# EAGLE design LED Matrix Driver(HT16K33) v1.0 (EAGLE 6.4)
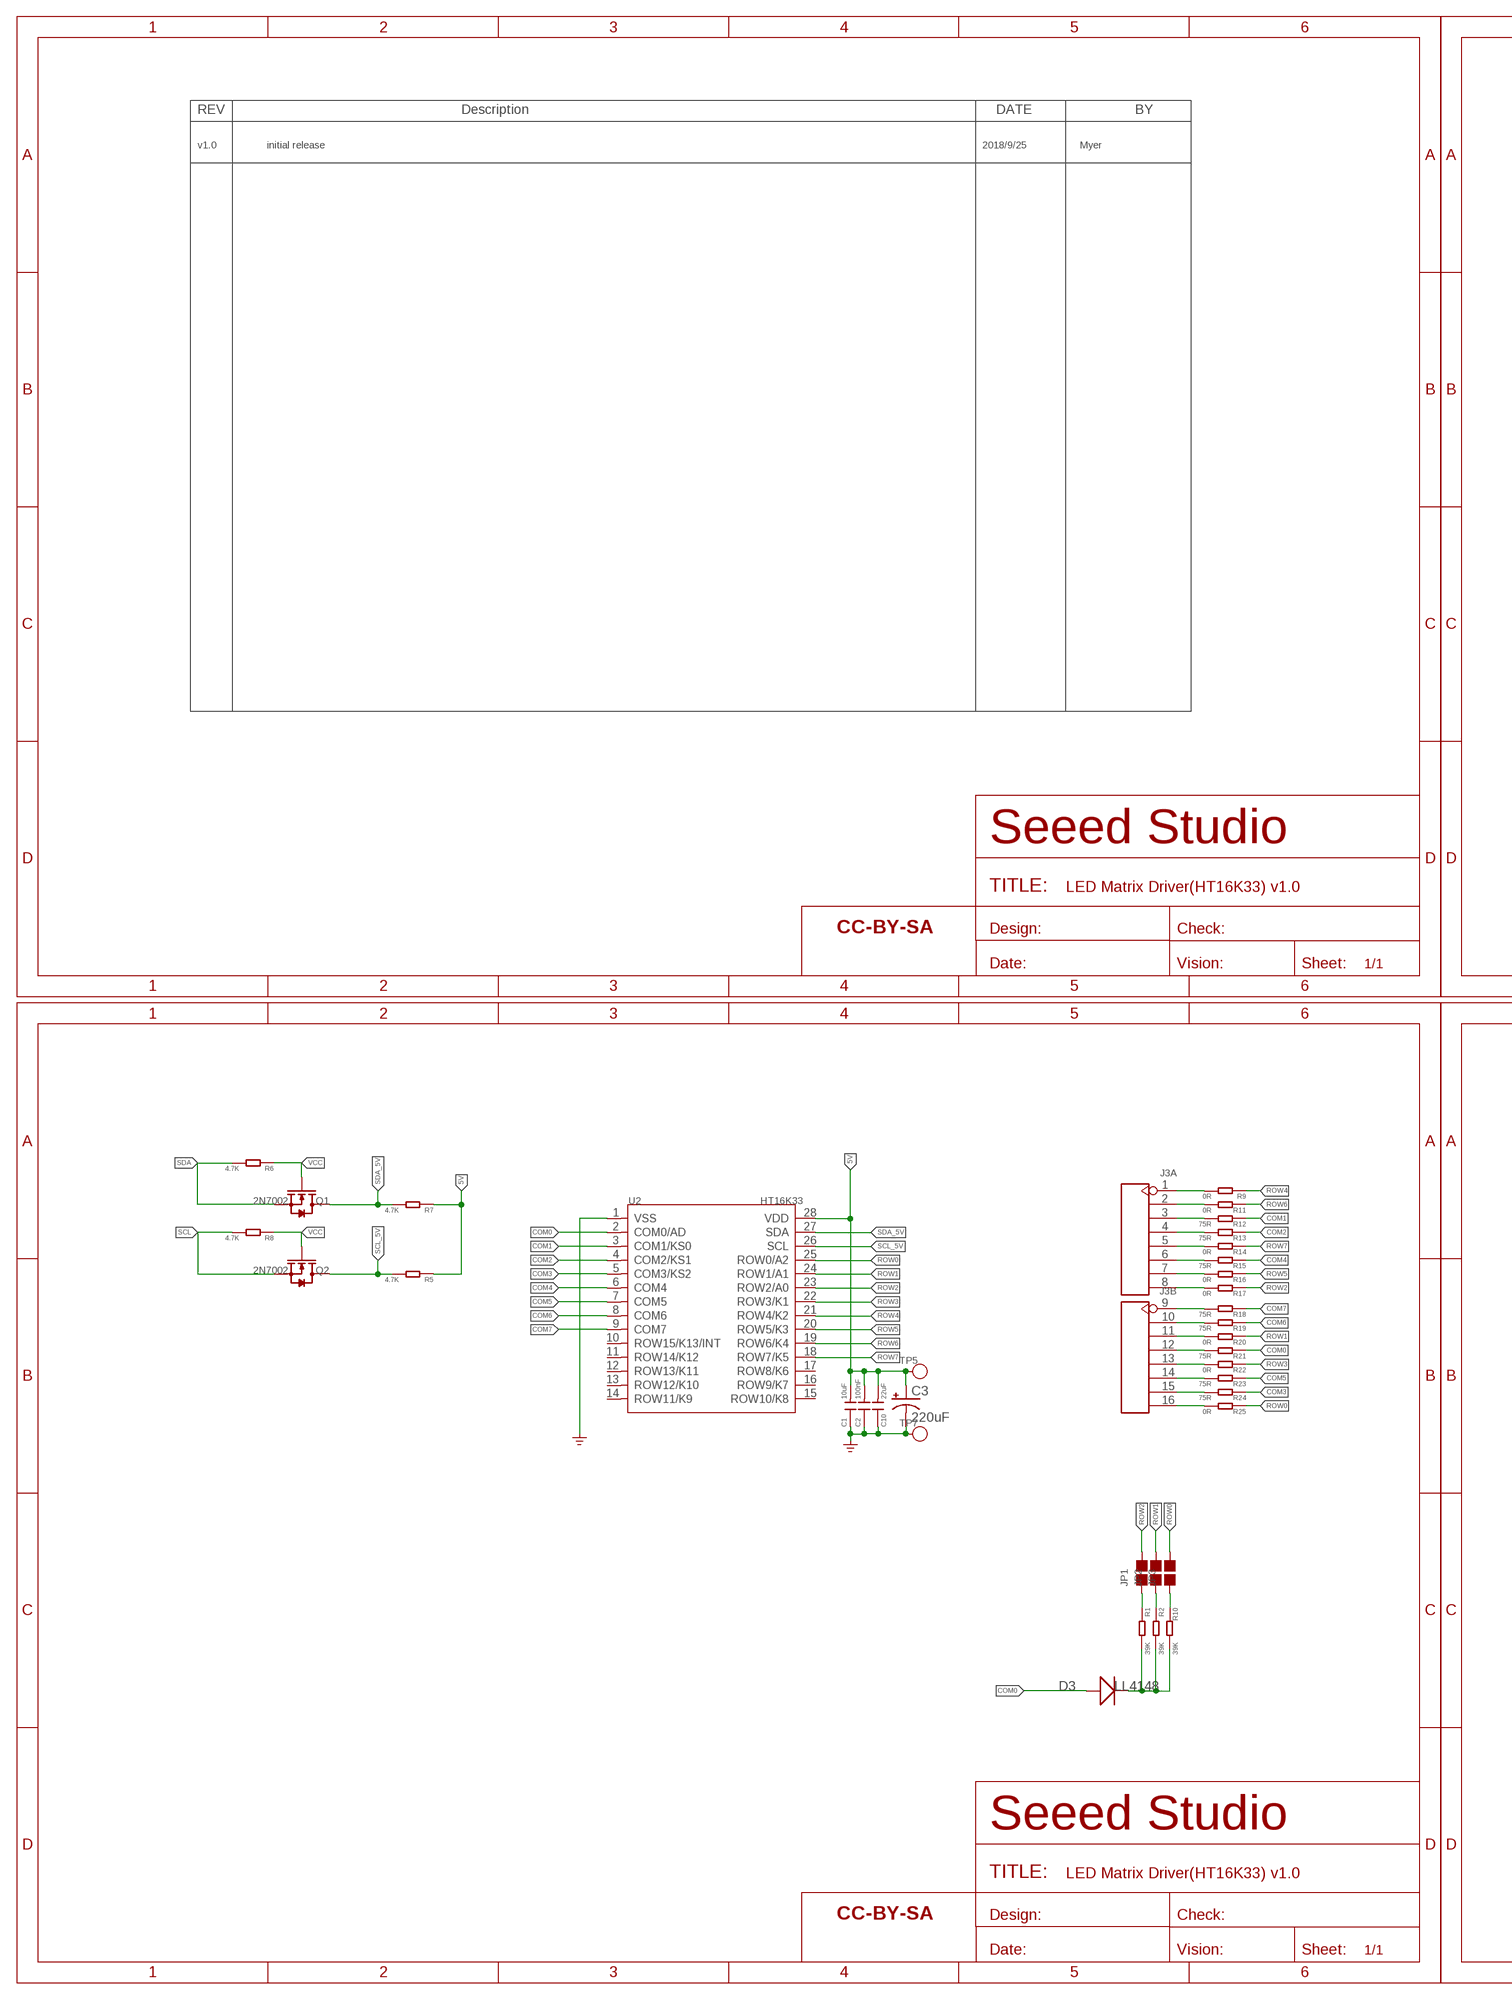
[diagram p0: schematic, sheet 1, part 1 of 2]
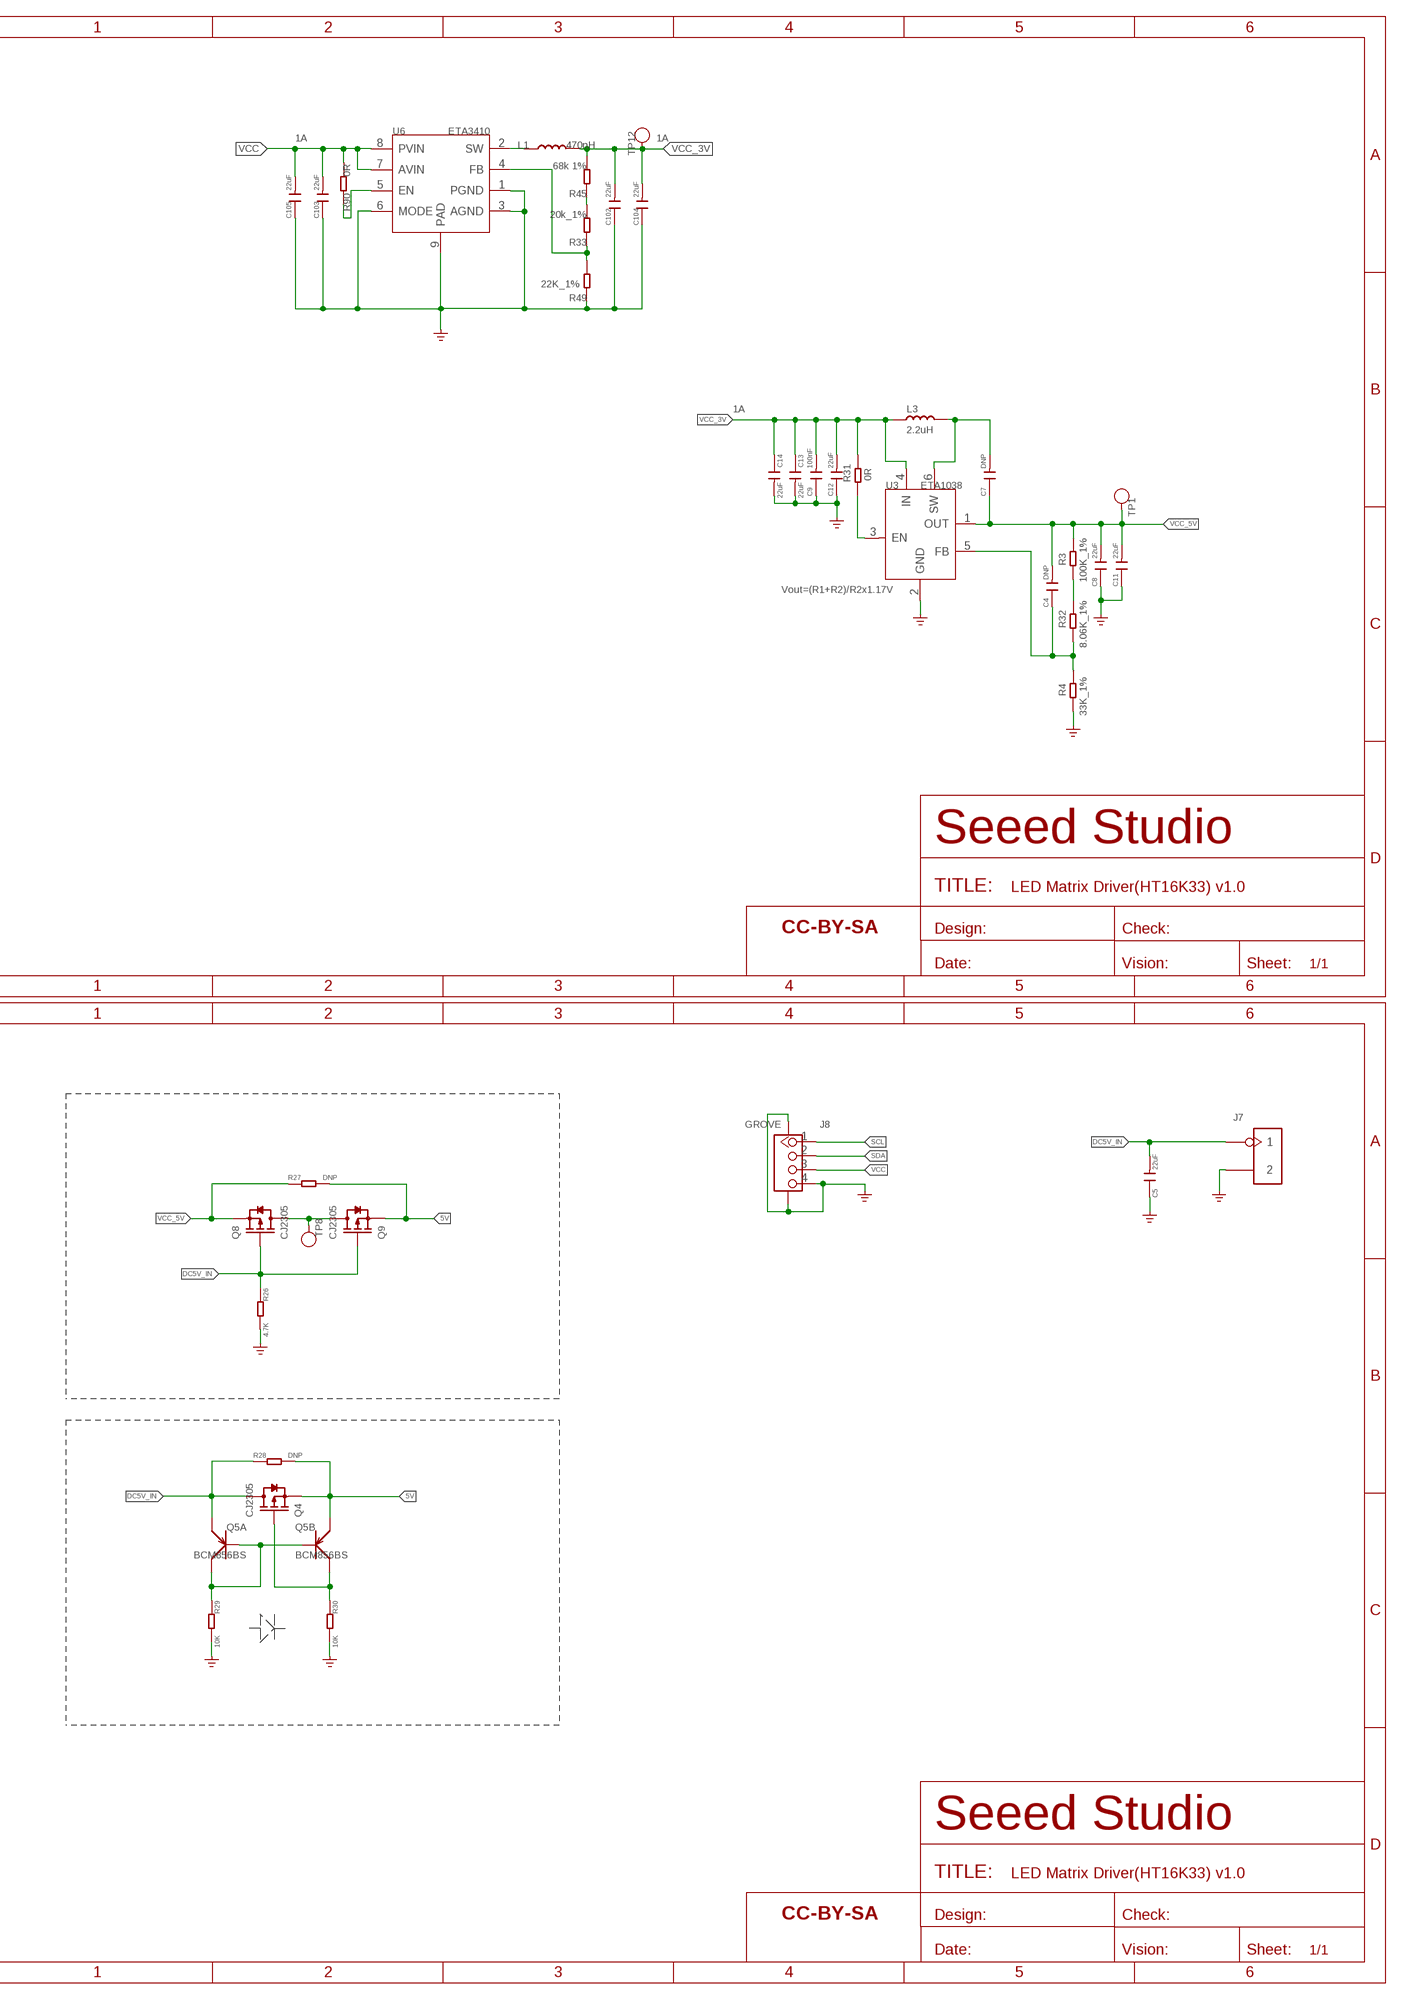
[diagram p1: schematic, sheet 1, part 2 of 2]

## Parts
C1  10uF  C-0805  [C0805]
C2  100nF  C-0603  [C0603]
C3  220uF  CPOL-USD  [PANASONIC_D]
C4  DNP  C-0603  [C0603]
C5  22uF  C-0805  [C0805]
C7  DNP  C-0603  [C0603]
C8  22uF  C-0603  [C0603]
C9  100nF  C-0603  [C0603]
C10  22uF  C-0805  [C0805]
C11  22uF  C-0603  [C0603]
C12  22uF  C-0603  [C0603]
C13  22uF  C-0603  [C0603]
C14  22uF  C-0603  [C0603]
C102  22uF  C-0603  [C0603]
C103  22uF  C-0603  [C0603]
C104  22uF  C-0603  [C0603]
C105  22uF  C-0603  [C0603]
D3  LL4148  D'1N4148-SMD'  [DO-35-SMD]
FR1  SEEEDSTUDIO-OPEN-SCH-FRAME  [SEEEDSTUDIO-PCB-FRAME]
FR2  SEEEDSTUDIO-OPEN-SCH-FRAME  [SEEEDSTUDIO-PCB-FRAME]
FR3  SEEEDSTUDIO-OPEN-SCH-FRAME  [SEEEDSTUDIO-PCB-FRAME]
J3  HEADER-1X8PX2-LED-28.5MM  [H8X2-SMD-2.54-28.5MM]
J7  HEADER-2P-65/35MIL  [H2-2.54]
J8  GROVE  GROVE-CONNECTOR-SMD'DD'  [HW4-SMD-2.0]
JP1  JP-2P-NO  [2P-SMD-NO]
JP2  JP-2P-NO  [2P-SMD-NO]
JP3  JP-2P-NO  [2P-SMD-NO]
L1  470nH  L-MPM201610SR33_T  [L201610]
L3  2.2uH  INDUCTOR/FERRITE-BEAD'0806'  [L0806]
Q1  2N7002  MOSFET-N'SOT23'  [SOT-23]
Q2  2N7002  MOSFET-N'SOT23'  [SOT-23]
Q4  CJ2305  MOSFET-P'SI2323CDS/SI2305DS<BR>'  [SOT-23]
Q5  BCM856BS  TRANSISTOR-DUAL-PNP  [SOT-363]
Q8  CJ2305  MOSFET-P'SI2323CDS/SI2305DS<BR>'  [SOT-23]
Q9  CJ2305  MOSFET-P'SI2323CDS/SI2305DS<BR>'  [SOT-23]
R1  39K  R-0603  [R0603]
R2  39K  R-0603  [R0603]
R3  100K_1%  R-0603  [R0603]
R4  33K_1%  R-0603  [R0603]
R5  4.7K  R-0603  [R0603]
R6  4.7K  R-0603  [R0603]
R7  4.7K  R-0603  [R0603]
R8  4.7K  R-0603  [R0603]
R9  0R  R-0603  [R0603]
R10  39K  R-0603  [R0603]
R11  0R  R-0603  [R0603]
R12  75R  R-0603  [R0603]
R13  75R  R-0603  [R0603]
R14  0R  R-0603  [R0603]
R15  75R  R-0603  [R0603]
R16  0R  R-0603  [R0603]
R17  0R  R-0603  [R0603]
R18  75R  R-0603  [R0603]
R19  75R  R-0603  [R0603]
R20  0R  R-0603  [R0603]
R21  75R  R-0603  [R0603]
R22  0R  R-0603  [R0603]
R23  75R  R-0603  [R0603]
R24  75R  R-0603  [R0603]
R25  0R  R-0603  [R0603]
R26  4.7K  R-0603  [R0603]
R27  DNP  R-0603  [R0603]
R28  DNP  R-0603  [R0603]
R29  10K  R-0603  [R0603]
R30  10K  R-0603  [R0603]
R31  0R  R-0603  [R0603]
R32  8.06K_1%  R-0603  [R0603]
R33  20k_1%  R-0603  [R0603]
R45  68k 1%  R-0603  [R0603]
R49  22K_1%  R-0603  [R0603]
R90  0R  R-0603  [R0603]
TP1  TEST-POINT'4545'  [TP-D45MIL]
TP5  TEST-POINT'4545'  [TP-D45MIL]
TP7  TEST-POINT'4545'  [TP-D45MIL]
TP8  TEST-POINT'4545'  [TP-D45MIL]
TP12  TEST-POINT'4545'  [TP-D45MIL]
U2  HT16K33  DRIVER-HT16K33-28P  [SOP28-1.27-18.2X7.4MM]
U3  ETA1038  CONVERTER-ETA1038  [SOT-23-6]
U6  ETA3410  CONVERTER-ETA3410  [DFN8G-0.5-2X2MM]
U$1  SEEEDSTUDIO-OPEN-SCH-FRAME  [SEEEDSTUDIO-PCB-FRAME]

## Nets
5V: C1.2 C2.2 C3.+ C10.2 Q4.2(S) Q5.4(B:E) Q9.2(S) R5.1 R7.1 R27.2 R28.2 TP5.T U2.28(VDD)
COM0: D3.A(+) R21.1 U2.2(COM0/AD)
COM1: R12.1 U2.3(COM1/KS0)
COM2: R13.1 U2.4(COM2/KS1)
COM3: R24.1 U2.5(COM3/KS2)
COM4: R15.1 U2.6(COM4)
COM5: R23.1 U2.7(COM5)
COM6: R19.1 U2.8(COM6)
COM7: R18.1 U2.9(COM7)
DC5V_IN: C5.2 J7.1 Q4.3(D) Q5.1(A:E) Q8.1(G) Q9.1(G) R26.1 R28.1
GND: C1.1 C2.1 C3.- C5.1 C8.1 C9.1 C10.1 C11.1 C12.1 C13.2 C14.2 C102.1 C103.1 C104.1 C105.1 J7.2 J8.4 J8.SS1 J8.SS2 R4.1 R26.2 R29.2 R30.2 R49.1 TP7.T U2.1(VSS) U3.2(GND) U6.1(PGND) U6.3(AGND) U6.6(MODE) U6.9(PAD) ; supply symbol labelled GND_POWER
N$1: D3.C(-) R1.2 R2.2 R10.2
N$2: JP1.1 R1.1
N$3: L1.1 U6.2(SW)
N$4: R90.1 U6.5(EN)
N$5: J3.1 R9.2
N$6: JP2.1 R2.1
N$7: JP3.1 R10.1
N$8: R33.2 R45.1
N$10: J3.2 R11.2
N$11: Q5.2(A:B) Q5.5(B:B) Q5.6(A:C) R29.1
N$12: J3.3 R12.2
N$13: Q4.1(G) Q5.3(B:C) R30.1
N$14: J3.4 R13.2
N$15: J3.5 R14.2
N$16: J3.6 R15.2
N$17: J3.7 R16.2
N$18: J3.8 R17.2
N$19: J3.9 R18.2
N$20: J3.10 R19.2
N$21: J3.11 R20.2
N$22: J3.12 R21.2
N$23: J3.13 R22.2
N$24: J3.14 R23.2
N$25: J3.15 R24.2
N$26: J3.16 R25.2
N$28: C7.2 L3.2 U3.6(SW)
N$29: Q8.3(D) Q9.3(D) TP8.T
N$30: C4.1 R4.2 R32.2 U3.5(FB)
N$31: R31.2 U3.3(EN)
N$32: R3.2 R32.1
N$49: R33.1 R49.2 U6.4(FB)
ROW0: JP3.2 R25.1 U2.25(ROW0/A2)
ROW1: JP2.2 R20.1 U2.24(ROW1/A1)
ROW2: JP1.2 R17.1 U2.23(ROW2/A0)
ROW3: R22.1 U2.22(ROW3/K1)
ROW4: R9.1 U2.21(ROW4/K2)
ROW5: R16.1 U2.20(ROW5/K3)
ROW6: R11.1 U2.19(ROW6/K4)
ROW7: R14.1 U2.18(ROW7/K5)
SCL: J8.1 Q2.2(S) R8.2
SCL_5V: Q2.3(D) R5.2 U2.26(SCL)
SDA: J8.2 Q1.2(S) R6.2
SDA_5V: Q1.3(D) R7.2 U2.27(SDA)
VCC: C103.2 C105.2 J8.3 Q1.1(G) Q2.1(G) R6.1 R8.1 R90.2 U6.7(AVIN) U6.8(PVIN)
VCC_3V: C9.2 C12.2 C13.1 C14.1 C102.2 C104.2 L1.2 L3.1 R31.1 R45.2 TP12.T U3.4(IN)
VCC_5V: C4.2 C7.1 C8.2 C11.2 Q8.2(S) R3.1 R27.1 TP1.T U3.1(OUT)
Unconnected: U2.10(ROW15/K13/INT) U2.11(ROW14/K12) U2.12(ROW13/K11) U2.13(ROW12/K10) U2.14(ROW11/K9) U2.15(ROW10/K8) U2.16(ROW9/K7) U2.17(ROW8/K6)

## Notes on the sheet
- 1A | 1A
- v1.0 | initial release | 2018/9/25 | Myer
- 1A
- Vout=(R1+R2)/R2x1.17V

## Library data of the parts
C1 C2 C4 C5 C7-C14 C102-C105 = Discrete-small:C*: Ceramic Capacitors
C3 = rcl:CPOL-US: POLARIZED CAPACITOR, American symbol
D3 = Discrete:D*
FR1-FR3 U$1 = moudle-new:SEEEDSTUDIO-OPEN-SCH-FRAME
J3 = Connector-new:HEADER-1X8PX2-LED
J7 = Connector-new:HEADER-2P
J8 = Connector-new:GROVE-CONNECTOR-SMD: 4P-SMD-2.0:320110030;4P-SMD-2.0-90D:320110032
JP1-JP3 = Discrete-new:JP-2P-NO
L1 = Discrete-new:L
L3 = Discrete-new:INDUCTOR/FERRITE-BEAD
Q1 Q2 = Discrete-new:MOSFET-N
Q4 Q8 Q9 = Discrete-new:MOSFET-P
Q5 = Discrete-new:TRANSISTOR-DUAL-PNP
R1-R33 R45 R49 R90 = Discrete-small:R*
TP1 TP5 TP7 TP8 TP12 = Discrete-new:TEST-POINT; PARTNO: DNP
U2 = IC-new:DRIVER-HT16K33-28P
U3 = IC-new:CONVERTER-ETA1038
U6 = IC-new:CONVERTER-ETA3410: 3MHZ 2A High Step-Down Converter in DFN2x2-8L Package

## Board
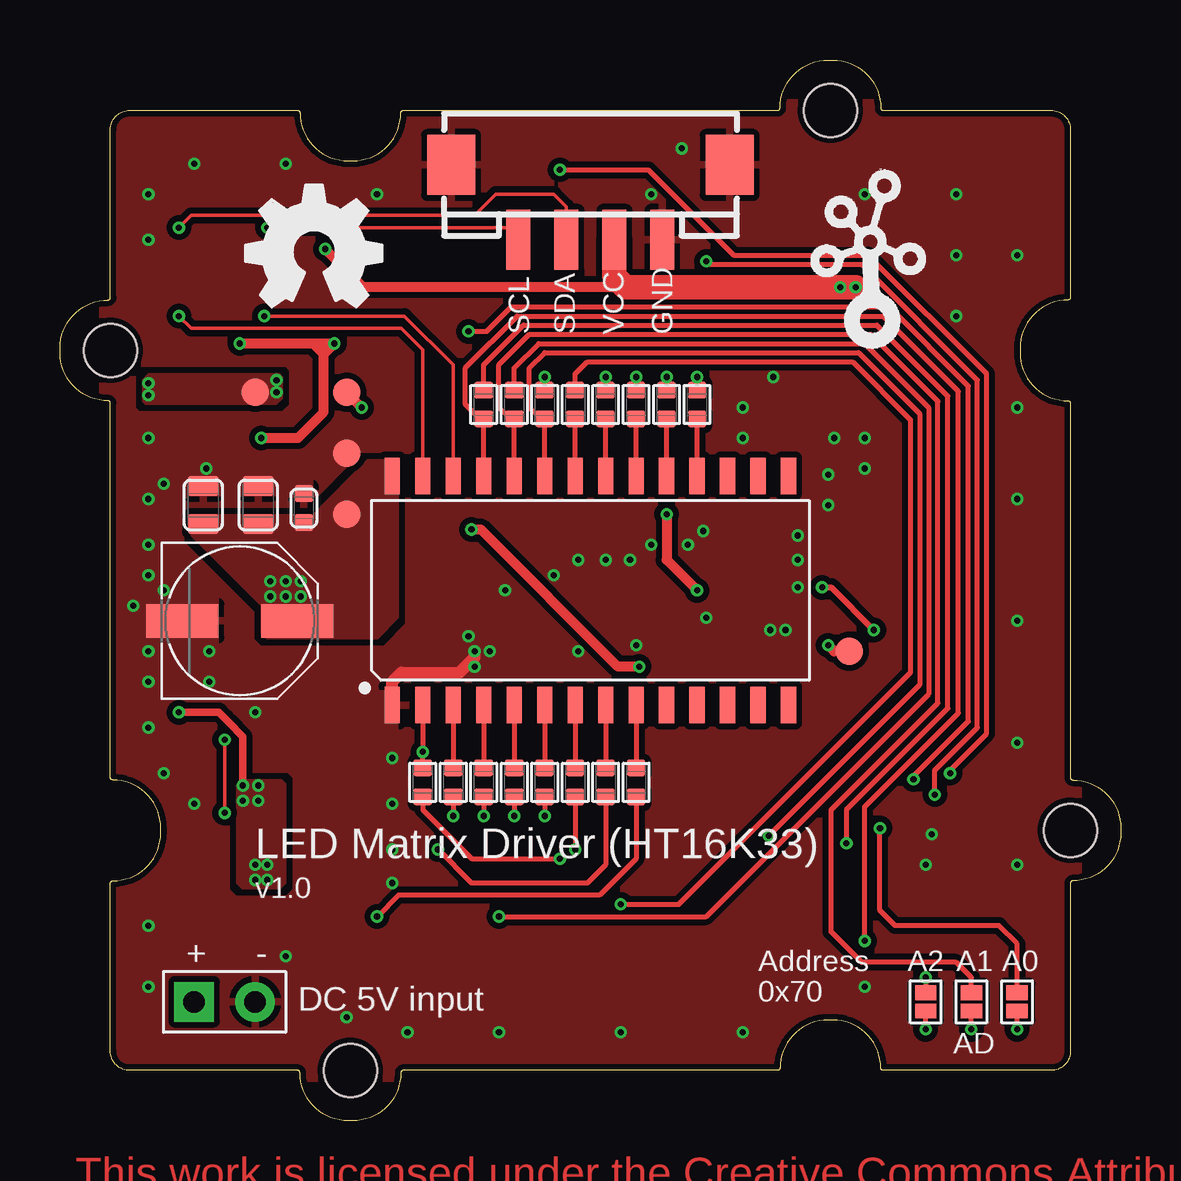
[diagram p2: board, top side]
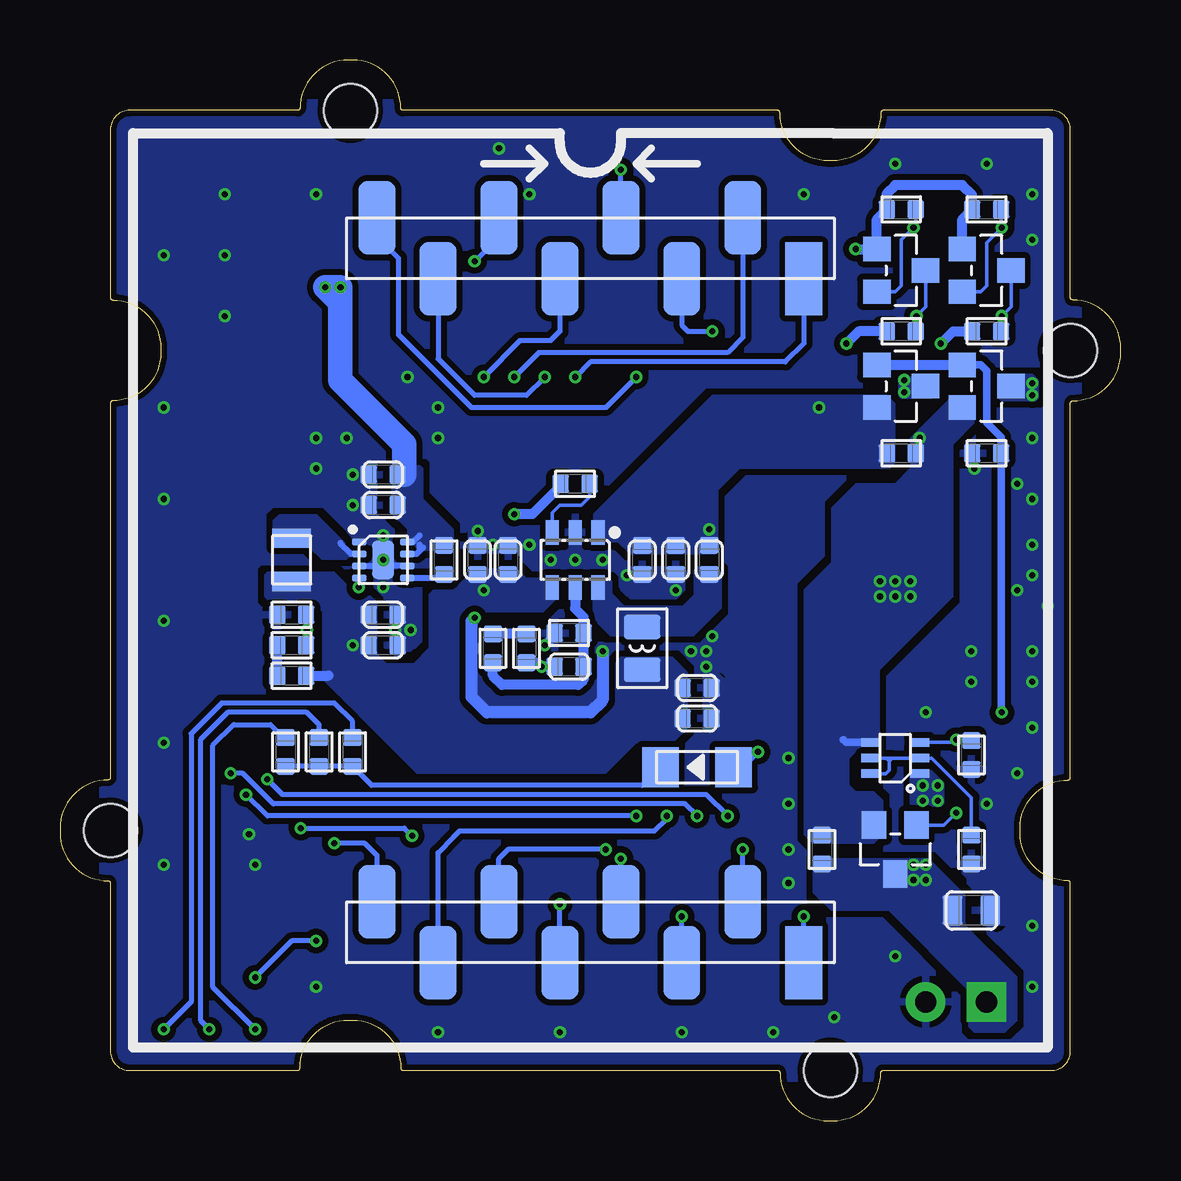
[diagram p3: board, bottom side, seen from below]

Size 44.2 x 44.2 mm. Coordinates in mm from the lower left corner, seen from the top.
Copper layers (1*16): Top 0.035mm / dielectric 1.5mm / Bottom 0.035mm
Design rules "SeeedStudio_2layer_DRU_no_angle_20140221 *": minimum track width 1mil, minimum drill 10mil, track to track 6mil, track to pad 6mil, pad to pad 6mil, via to via 6mil, smd to smd 0mil, copper to edge 10mil, drill to drill 10mil, minimum pad ring 4mil, minimum via ring 4mil, stop-mask expansion 2mil, vias tented up to drill 25mil, thermal gap 10mil

### Footprints (pad centres in the part's own frame; a part is rotated, then mirrored left to right if it is on the bottom)
C0805 = smd 0.819 x 1.27: 1 -0.79,0; 2 0.79,0
C0603 = smd 0.762 x 0.696: 1 0,0.602; 2 0,-0.602
PANASONIC_D = smd 3 x 1.4: + 2.4,0; - -2.4,0
DO-35-SMD = smd 1.524 x 1.676: A -1.524,0; C 1.524,0
H8X2-SMD-2.54-28.5MM = smd 3.048 x 1.524: 1 -12.98,8.89; 2 -15.52,6.35; 3 -12.98,3.81; 4 -15.52,1.27; 5 -12.98,-1.27; 6 -15.52,-3.81; 7 -12.98,-6.35; 8 -15.52,-8.89; 9 15.52,8.89; 10 12.98,6.35; 11 15.52,3.81; 12 12.98,1.27; 13 15.52,-1.27; 14 12.98,-3.81; 15 15.52,-6.35; 16 12.98,-8.89
H2-2.54 = drill 0.889 pad 1.651 square: 1 0,1.27 | drill 0.889 pad 1.651: 2 0,-1.27
HW4-SMD-2.0 = smd 1 x 2.5: 1 -3,0; 2 -1,0; 3 1,0; 4 3,0 | smd 2 x 2.5: SS1 -5.8,3.123; SS2 5.8,3.123
2P-SMD-NO = smd 0.889 x 0.61: 1 0,0.381; 2 0,-0.381
L201610 = smd 0.8 x 1.6: 1 -0.9,0; 2 0.9,0
L0806 = smd 1.016 x 1.524: 1 -0.889,0; 2 0.889,0
SOT-23 = smd 1.143 x 1.016: 1 1.016,-0.889; 2 1.016,0.889; 3 -1.016,0
SOT-363 = smd 0.35 x 0.8: 1 -0.65,-1.025; 2 0,-1.025; 3 0.65,-1.025; 4 0.65,1.025; 5 0,1.025; 6 -0.65,1.025
R0603 = smd 0.762 x 0.696: 1 0,0.602; 2 0,-0.602
TP-D45MIL = smd 1.143 x 1.143: T 0,0
SOP28-1.27-18.2X7.4MM = smd 0.635 x 1.524: 1 -8.255,-4.775; 2 -6.985,-4.775; 3 -5.715,-4.775; 4 -4.445,-4.775; 5 -3.175,-4.775; 6 -1.905,-4.775; 7 -0.635,-4.775; 8 0.635,-4.775; 9 1.905,-4.775; 10 3.175,-4.775; 11 4.445,-4.775; 12 5.715,-4.775; 13 6.985,-4.775; 14 8.255,-4.775; 15 8.255,4.775; 16 6.985,4.775; 17 5.715,4.775; 18 4.445,4.775; 19 3.175,4.775; 20 1.905,4.775; 21 0.635,4.775; 22 -0.635,4.775; 23 -1.905,4.775; 24 -3.175,4.775; 25 -4.445,4.775; 26 -5.715,4.775; 27 -6.985,4.775; 28 -8.255,4.775
SOT-23-6 = smd 0.55 x 1.016: 1 -0.95,-1.143; 2 0,-1.143; 3 0.95,-1.143; 4 0.95,1.143; 5 0,1.143; 6 -0.95,1.143
DFN8G-0.5-2X2MM = smd 0.6 x 0.3: 1 -1,0.75; 2 -1,0.25; 3 -1,-0.25; 4 -1,-0.75; 5 1,-0.75; 6 1,-0.25; 7 1,0.25; 8 1,0.75 | smd 0.9 x 1.6: 9 0,0
2X2U-DIM-W/-DRILL = hole 2.2: 10,20; -20,10; -10,-20; 20,-10

### Placement (x,y rotation side)
C1  8.26,25.66 270 top
C2  10.16,25.53 0 top
C3  7.5,20.83 0 top
C4  22.99,18.93 270 bottom
C5  6.23,8.77 180 bottom
C7  17.15,23.37 0 bottom
C8  19.94,23.37 180 bottom
C9  25.53,23.37 0 bottom
C10  5.97,25.66 270 top
C11  18.54,23.37 180 bottom
C12  26.8,23.37 0 bottom
C13  17.66,18.04 90 bottom
C14  17.66,16.77 90 bottom
C102  30.74,21.08 270 bottom
C103  30.74,26.93 90 bottom
C104  30.74,19.81 270 bottom
C105  30.74,25.66 90 bottom
D3  17.66,14.73 180 bottom
FR1  0.64,-6.6 0 top  (outside the outline)
FR2  0.64,-19.81 0 top  (outside the outline)
FR3  0.64,-26.41 0 top  (outside the outline)
J3  22.1,22.1 270 bottom
J7  6.86,4.96 90 top
J8  22.1,36.7 0 top
JP1  39.88,4.96 180 top
JP2  37.98,4.96 180 top
JP3  36.07,4.96 180 top
L1  34.55,23.37 270 bottom
L3  19.94,19.69 90 bottom
Q1  5.59,35.44 180 bottom
Q2  9.15,35.44 180 bottom
Q4  9.4,11.31 90 bottom
Q5  9.4,15.12 90 bottom
Q8  9.15,30.61 180 bottom
Q9  5.59,30.61 180 bottom
R1  32.01,15.37 0 bottom
R2  33.4,15.37 0 bottom
R3  24.77,19.69 180 bottom
R4  22.99,20.32 90 bottom
R5  9.15,32.9 90 bottom
R6  5.59,37.98 90 bottom
R7  5.59,32.9 90 bottom
R8  9.15,37.98 90 bottom
R9  22.74,29.85 180 top
R10  34.8,15.37 0 bottom
R11  25.28,29.85 180 top
R12  16.39,14.1 0 top
R13  17.66,14.1 0 top
R14  26.55,29.85 180 top
R15  20.2,14.1 0 top
R16  24.01,29.85 180 top
R17  20.2,29.85 180 top
R18  24.01,14.1 0 top
R19  22.74,14.1 0 top
R20  18.93,29.85 180 top
R21  15.12,14.1 0 top
R22  21.46,29.85 180 top
R23  21.46,14.1 0 top
R24  18.93,14.1 0 top
R25  17.66,29.85 180 top
R26  5.59,27.82 270 bottom
R27  9.15,27.82 90 bottom
R28  12.45,11.31 180 bottom
R29  6.23,11.31 0 bottom
R30  6.23,15.24 0 bottom
R31  22.74,26.55 90 bottom
R32  26.16,19.69 0 bottom
R33  34.55,19.81 270 bottom
R45  34.55,18.54 90 bottom
R49  34.55,21.08 90 bottom
R90  28.2,23.37 180 bottom
TP1  11.94,30.36 0 top
TP5  11.94,25.28 0 top
TP7  11.94,27.82 0 top
TP8  8.13,30.36 0 top
TP12  32.9,19.56 270 top
U2  22.1,22.1 0 top
U3  22.74,23.37 180 bottom
U6  30.74,23.37 0 bottom
U$1  0.64,-13.21 0 top  (outside the outline)
U$3  [2X2U-DIM-W/-DRILL]  22.1,22.1 0 top
U$4  [OSHW_FILLX200_NOTEXT]  7.75,33.91 0 top
U$5  [TWIGLOGO]  33.78,33.15 0 top

### Tracks (layer width: path | path; a pad name or v marks a point on that pad's centre or on a via)
5V  (via drill 0.25 pad 0.51)
  Top 0.406: 10.99,32.39 v11.43,32.39 10.99,31.94 | 10.99,32.39 10.54,32.39 | 10.54,32.39 v7.5,32.39 | v8.38,28.45 9.91,28.45 10.99,29.53 10.99,31.92 10.99,31.94 | 10.99,31.94 10.99,32.39 | 10.99,31.94 10.54,32.39
  Bottom 0.305: Q5.4 11.45,15.77 11.56,15.88
  Bottom 0.406: R5.1 10.92,32.9 v11.43,32.39 | v7.5,32.39 6.99,32.9 R7.1
  other vias: 8.77,21.85 9.4,21.85 10.04,21.85 10.04,22.48 9.4,22.48 8.77,22.48
  pour Bottom (isolate 0.254, rank 2, no thermals): 12.83,11.56 10.29,11.56 9.91,11.94 9.91,13.34 10.29,13.72 11.05,13.72 11.31,13.97 11.31,15.12 10.67,15.75 10.16,15.75 10.04,15.88 10.04,18.8 6.99,21.85 6.99,23.24 7.11,23.37 11.94,23.37 13.21,22.1 13.21,11.94
  pour Bottom (isolate 0.254, no thermals): 11.94,23.12 6.99,23.12 6.99,28.2 6.1,29.09 6.1,29.85 6.35,30.1 7.11,30.1 8.77,28.45 8.77,27.18 9.4,26.55 11.05,26.55 12.07,25.53 12.07,23.24
  pour Top (isolate 0.254, no thermals): 9.65,20.07 8.64,20.07 8.38,20.32 8.38,21.46 5.46,24.39 5.46,25.02 5.72,25.28 10.54,25.28 12.83,27.56 13.85,27.56 14.1,27.31 14.1,20.96 13.21,20.07
COM0  (via drill 0.25 pad 0.51)
  Top 0.203: U2.2 v15.12,15.37 R21.1
  Bottom 0.203: D3.A 15.75,14.73 v15.12,15.37
COM1
  Top 0.203: U2.3 R12.1
COM2
  Top 0.203: U2.4 R13.1
COM3
  Top 0.203: U2.5 R24.1
COM4
  Top 0.203: U2.6 R15.1 20.2,14.61
COM5
  Top 0.203: U2.7 R23.1
COM6
  Top 0.203: U2.8 R19.1
COM7
  Top 0.203: U2.9 R18.1
DC5V_IN  (via drill 0.25 pad 0.51)
  Top 0.305: v7.62,13.97 7.62,16 7.05,16.58 6.86,16.77 6.61,17.02 v4.96,17.02
  Bottom 0.305: Q9.1 5.84,31.5 5.59,31.24 5.59,29.09 4.99,28.48 R26.1 4.99,17.05 v4.96,17.02
  Bottom 0.406: Q8.1 Q9.1
  other vias: 8.26,13.97 7.62,13.34 8.26,13.34 8.13,10.67 8.64,10.67 8.64,10.04 8.13,10.04
  pour Bottom (isolate 0.254, no thermals): 5.59,3.69 4.83,3.69 4.32,4.19 4.32,5.97 6.48,8.13 6.48,9.4 8,10.92 12.45,10.92 12.83,10.54 12.83,9.53 12.07,8.77 9.68,8.77 6.35,5.44 6.35,3.94 6.1,3.69
  pour Top (isolate 0.254, no thermals): 8.26,14.23 9.22,14.23 9.4,14.05 9.4,9.91 9.15,9.65 7.62,9.65 7.37,9.91 7.37,13.97 7.62,14.23
  pour Bottom (isolate 0.254, no thermals): 8.26,14.61 7.88,14.61 7.37,14.1 7.37,13.21 7.5,13.08 8.64,13.08 8.77,13.21 8.77,14.48 8.64,14.61
GND  (via drill 0.25 pad 0.51)
  Top 0.508: U2.1 13.85,18.29 14.23,18.67 16.64,18.67 17.27,19.31 v17.27,19.56
  Bottom 0.254: U6.3 30.74,23.12 30.73,23.12 U6.6
  Bottom 0.305: R26.2 6.19,27.27 v6.1,27.18
  Bottom 0.406: R4.1 23.59,20.23 v24.01,19.81
  Bottom 0.508: v21.59,19.56 21.59,17.53 22.1,17.02 26.42,17.02 27.05,17.66 27.05,20.83 v26.93,20.96
  other vias: 18.54,22.1 20.58,22.74 21.59,23.37 22.74,23.37 23.75,23.37 24.64,24.01 26.16,24.01 26.8,24.58 17.91,19.56 13.85,13.21 13.85,11.31 13.85,9.91 30.74,23.37 30.74,24.39 30.74,22.23 30.23,20.45 29.59,20.45 39.88,20.83 32.01,25.66 32.01,26.93 24.64,38.61 25.91,40.52 13.85,15.12 17.27,18.93 17.02,20.2 39.88,15.75 39.88,10.67 36.07,10.67 36.32,11.94 39.88,25.91 39.88,29.72 37.34,33.53 37.34,38.61 39.88,36.07 37.34,36.07 33.53,38.61 33.53,27.18 33.53,28.45 32.26,28.45 28.45,28.45 28.45,29.72 29.72,30.99 33.53,5.59 28.45,3.69 23.37,3.69 18.29,3.69 14.48,3.69 11.94,4.32 9.4,6.86 3.69,5.59 3.69,8.13 4.32,14.48 3.69,28.45 3.69,36.7 3.69,38.61 5.59,39.88 9.4,39.88 13.21,38.61 3.05,21.46 3.69,19.56 4.32,22.1 3.69,22.74 3.69,24.01 3.69,25.91 4.32,26.55 6.23,19.56 6.23,18.29 3.69,18.29 8.13,17.02 3.69,16.39 5.59,13.21
  pour Bottom (isolate 0.254, no thermals): 20.45,23.12 18.29,23.12 18.16,22.99 18.16,22.1 18.42,21.85 20.58,21.85 20.83,22.1 20.83,22.61 21.21,22.99 24.51,22.99 25.15,23.62 26.93,23.62 27.18,23.88 27.18,24.51 26.8,24.89 24.64,24.89 24.39,24.64 24.39,24.13 24.01,23.75 23.12,23.75 22.99,23.88 22.99,24.77 22.86,24.89 22.61,24.89 22.48,24.77 22.48,23.88 22.35,23.75 21.08,23.75
  pour Top (isolate 0.254, no thermals): 13.72,17.91 12.7,17.91 12.32,17.53 12.32,15.62 12.83,15.12 13.85,15.12 14.1,15.37 14.1,17.66 13.85,17.91
  pour Bottom (isolate 0.254, no thermals): 30.23,19.56 29.59,19.56 29.34,19.81 29.34,21.46 30.36,22.48 30.36,24.64 30.99,25.28 30.99,27.69 31.12,27.82 32.01,27.82 32.26,27.56 32.26,24.51 31.88,24.13 31.24,24.13 31.12,24.01 31.12,22.23 30.48,21.59 30.48,19.69 30.36,19.56
  pour Bottom (isolate 0.254, no thermals): 5.59,11.05 4.96,11.05 4.19,10.29 4.19,8.51 4.57,8.13 5.46,8.13 5.72,8.38 5.72,9.4 6.61,10.29 6.61,10.8 6.35,11.05
  pour Bottom (isolate 0.254, rank 6): 1.78,42.42 42.42,42.42 42.42,1.78 1.78,1.78
  pour Top (isolate 0.254, rank 6): 1.78,42.42 42.42,42.42 42.42,1.78 1.78,1.78
  pour Bottom (isolate 0.254, no thermals): 18.04,19.81 17.15,19.81 16.89,19.56 16.89,18.8 16.26,18.16 16.26,16.39 16.52,16.12 17.26,16.12 17.4,16.26 17.4,18.67 18.16,19.43 18.16,19.69
  pour Bottom (isolate 0.254, no thermals): 21.85,18.29 21.97,18.29 22.48,17.78 25.78,17.78 26.55,18.54 26.93,18.54 27.05,18.42 27.05,17.66 26.42,17.02 22.23,17.02 21.46,17.78 21.46,18.16 21.59,18.29
  pour Top (isolate 0.254, no thermals): 10.04,25.78 10.29,25.78 10.54,26.04 10.54,26.93 9.78,27.69 3.56,27.69 2.67,26.8 2.67,19.43 3.05,19.05 6.23,19.05 6.61,19.43 6.61,22.1 4.96,23.75 4.96,25.66 5.34,26.04 9.78,26.04
N$1
  Bottom 0.203: R10.2 R2.2 R1.2 31.21,13.97 19.94,13.97 D3.C
N$2  (via drill 0.25 pad 0.51)
  Top 0.203: v39.88,3.81 JP1.1
  Bottom 0.203: R1.1 32.01,16.64 32.77,17.4 37.47,17.4 38.74,16.13 38.74,4.96 v39.88,3.81
N$3
  Bottom 0.254: U6.2 32.07,23.62 32.51,24.07
  pour Bottom (isolate 0.254, no thermals): 34.42,25.28 33.53,25.28 32.01,23.75 32.01,23.62 32.26,23.37 33.28,23.37 33.78,23.88 35.05,23.88 35.31,24.13 35.31,25.02 35.05,25.28
N$4
  Bottom 0.254: U6.5 28.34,22.62 R90.1
N$5  (via drill 0.25 pad 0.51)
  Top 0.203: R9.2 v22.74,30.99
  Bottom 0.203: J3.1 13.21,32.39 13.97,31.62 22.1,31.62 v22.74,30.99
N$6  (via drill 0.25 pad 0.51)
  Top 0.203: v37.98,3.81 JP2.1
  Bottom 0.203: v37.98,3.81 38.36,4.19 38.36,15.88 37.21,17.02 33.91,17.02 33.4,16.51 R2.1
N$7  (via drill 0.25 pad 0.51)
  Top 0.203: v36.07,3.81 JP3.1
  Bottom 0.203: v36.07,3.81 37.85,5.59 37.85,15.62 36.96,16.51 35.44,16.51 34.89,15.97 R10.1
N$8
  Bottom 0.406: R45.1 35.15,19.78 35.18,19.81 R33.2
N$10  (via drill 0.25 pad 0.51)
  Top 0.203: R11.2 v25.28,30.99
  Bottom 0.203: J3.2 15.75,32.64 16.39,32.01 24.26,32.01 v25.28,30.99
N$11
  Bottom 0.152: R29.1 6.23,13.46 7.88,15.12 Q5.2 9.53,15.12 | Q5.5 9.78,15.12 | 9.78,15.12 9.65,15.12 | 9.65,15.12 9.53,15.12 | Q5.6 9.8,14.47 9.65,14.61 9.65,14.99 | 9.65,14.99 9.65,15.12 | 9.65,14.99 9.53,15.12 | 9.65,14.99 9.78,15.12
N$12  (via drill 0.25 pad 0.51)
  Top 0.203: v17.02,32.9 17.78,32.9 18.8,33.91 34.55,33.91 37.85,30.61 37.85,16.64 35.56,14.35 v35.56,14.23 | R12.2 v16.39,12.7
  Bottom 0.203: J3.3 18.29,33.15 18.04,32.9 v17.02,32.9 | v16.39,12.7 17.27,13.59 34.93,13.59 v35.56,14.23
N$13  (via drill 0.25 pad 0.51)
  Top 0.152: v6.86,12.83 v6.86,15.88
  Bottom 0.152: Q4.1 7.37,12.32 v6.86,12.83 | R30.1 6.83,15.84 v6.86,15.88 6.97,15.77 Q5.3
N$14  (via drill 0.25 pad 0.51)
  Top 0.203: v20.83,39.63 24.51,39.63 28.07,36.07 33.66,36.07 38.61,31.12 38.61,16.13 37.09,14.61 v37.09,14.48 | R13.2 v17.66,12.7
  Bottom 0.203: J3.4 v20.83,39.63 | v37.09,14.48 36.58,14.48 35.31,13.21 18.16,13.21 v17.66,12.7
N$15  (via drill 0.25 pad 0.51)
  Top 0.203: R14.2 v26.55,30.99
  Bottom 0.203: J3.5 23.37,32.9 23.75,32.51 25.02,32.51 v26.55,30.99
N$16  (via drill 0.25 pad 0.51)
  Top 0.203: v26.93,35.82 27.05,35.69 33.4,35.69 38.23,30.86 38.23,16.39 36.45,14.61 v36.45,13.59 | 20.2,13.59 R15.2 v20.2,12.7
  Bottom 0.203: J3.6 25.91,36.83 v26.93,35.82 | v20.2,12.7 35.56,12.7 v36.45,13.59
N$17  (via drill 0.25 pad 0.51)
  Top 0.203: R16.2 v24.01,30.99
  Bottom 0.203: J3.7 28.45,31.75 26.93,30.23 24.77,30.23 v24.01,30.99
N$18  (via drill 0.25 pad 0.51)
  Top 0.203: R17.2 v20.2,30.99
  Bottom 0.203: v20.2,30.99 21.46,29.72 27.05,29.72 30.1,32.77 30.1,35.94 30.99,36.83 J3.8
N$19  (via drill 0.25 pad 0.51)
  Top 0.203: R18.2 24.01,10.92 22.48,9.4 14.1,9.4 v13.21,8.51
  Bottom 0.203: J3.9 v13.21,8.51
N$20  (via drill 0.25 pad 0.51)
  Top 0.203: R19.2 22.74,10.67 21.97,9.91 17.15,9.91 v15.75,11.31
  Bottom 0.203: J3.10 v15.75,11.31
N$21  (via drill 0.25 pad 0.51)
  Top 0.203: R20.2 18.93,31.37 19.94,32.39 33.53,32.39 36.2,29.72 36.2,17.78 26.93,8.51 v18.29,8.51
  Bottom 0.203: J3.11 v18.29,8.51
N$22  (via drill 0.25 pad 0.51)
  Top 0.203: v20.83,10.92 17.15,10.92 15.12,12.96 R21.2
  Bottom 0.203: J3.12 v20.83,10.92
N$23  (via drill 0.25 pad 0.51)
  Top 0.203: R22.2 21.46,31.12 21.97,31.62 33.02,31.62 35.44,29.21 35.44,18.67 25.78,9.02 v23.37,9.02
  Bottom 0.203: J3.13 v23.37,9.02
N$24  (via drill 0.25 pad 0.51)
  Top 0.203: R23.2 v21.46,11.31
  Bottom 0.203: J3.14 25.91,10.92 25.53,11.31 v21.46,11.31
N$25  (via drill 0.25 pad 0.51)
  Top 0.203: R24.2 v18.93,12.7
  Bottom 0.203: J3.15 28.45,11.18 27.82,11.81 27.69,11.94 27.56,12.07 19.43,12.07 18.93,12.58 v18.93,12.7
N$26  (via drill 0.25 pad 0.51)
  Top 0.203: R25.2 17.66,31.5 19.31,33.15 34.04,33.15 37,30.19 37,17.18 32.77,12.96 v32.77,11.56
  Bottom 0.203: J3.16 30.99,11.05 31.5,11.56 v32.77,11.56
N$28
  pour Bottom (isolate 0.254, no thermals): 17.6,23.12 16.89,23.12 16.64,22.86 16.64,21.37 17.81,20.2 21.25,20.2 21.97,20.91 21.97,22.56 21.93,22.6 21.33,22.6 21.21,22.48 21.21,21.97 20.7,21.46 18.24,21.46 17.78,21.92 17.78,22.94
N$29  (via drill 0.25 pad 0.51)
  other vias: 9.02,30.86 9.02,30.36 3.69,30.74 3.69,30.23
  pour Bottom (isolate 0.254, no thermals): 8.51,31.12 9.15,31.12 9.27,30.99 9.27,30.23 9.15,30.1 7.88,30.1 7.75,30.23 7.75,30.99 7.88,31.12
  pour Bottom (isolate 0.254, no thermals): 4.45,31.12 3.69,31.12 3.43,30.86 3.43,30.1 3.56,29.97 4.96,29.97 5.08,30.1 5.08,30.99 4.96,31.12
  pour Top (isolate 0.254, no thermals): 9.02,31.12 3.69,31.12 3.43,30.86 3.43,29.97 3.56,29.85 9.02,29.85 9.27,30.1 9.27,30.99 9.15,31.12
N$30
  Bottom 0.406: U3.5 22.74,21.34 22.39,20.99 R4.2 C4.1 22.39,18.38 22.61,18.16 25.78,18.16 26.16,18.54 R32.2
N$31
  Bottom 0.152: U3.3 23.69,25.34 23.37,25.66 22.48,25.66 22.13,26 R31.2
N$32
  Bottom 0.406: R3.2 R32.1
N$49  (via drill 0.25 pad 0.51)
  Top 0.254: v31.75,22.23 32.13,22.23 v33.91,20.45
  Bottom 0.254: U6.4 31.74,22.24 v31.75,22.23 | R49.2 33.94,20.48 v33.91,20.45 33.94,20.42 R33.1
ROW0  (via drill 0.25 pad 0.51)
  Top 0.203: U2.25 R25.1 17.5,29.25 16.89,29.85 16.89,31.37 19.05,33.53 34.29,33.53 37.43,30.39 37.43,16.98 33.53,13.08 v33.53,7.5 | v36.07,5.97 JP3.2
  Bottom 0.203: v33.53,7.5 34.55,7.5 v36.07,5.97
ROW1
  Top 0.203: U2.24 R20.1 | 18.93,29.34 R20.1 | R20.1 18.77,29.25 18.29,29.72 18.29,31.5 19.56,32.77 33.78,32.77 36.58,29.97 36.58,17.4 32.13,12.96 32.13,7.88 33.4,6.61 37.34,6.61 37.98,5.97 JP2.2
ROW2  (via drill 0.25 pad 0.51)
  Top 0.203: U2.23 R17.1 20.04,29.25 19.56,29.72 19.56,31.37 20.2,32.01 33.28,32.01 35.82,29.47 35.82,18.16 v29.53,11.88 | JP1.2 39.88,7.37 39.12,8.13 34.8,8.13 34.16,8.77 v34.16,12.19
  Bottom 0.203: v34.16,12.19 29.85,12.19 v29.53,11.88
ROW3
  Top 0.203: U2.22 R22.1
ROW4
  Top 0.203: U2.21 R9.1
ROW5
  Top 0.203: U2.20 R16.1
ROW6
  Top 0.203: U2.19 R11.1
ROW7
  Top 0.203: U2.18 R14.1
SCL  (via drill 0.25 pad 0.51)
  Top 0.152: v8.64,37.21 18.67,37.21 19.1,36.78 J8.1
  Bottom 0.152: R8.2 8.54,37.31 v8.64,37.21 9.15,36.7 9.15,34.8 9.4,34.55 Q2.2
SCL_5V  (via drill 0.25 pad 0.51)
  Top 0.152: v8.51,33.53 14.35,33.53 16.39,31.5 U2.26
  Bottom 0.152: Q2.3 8.13,33.91 v8.51,33.53 8.54,33.5 R5.2
SDA  (via drill 0.25 pad 0.51)
  Top 0.152: v4.96,37.21 5.46,37.72 17.27,37.72 18.16,38.61 20.58,38.61 21.1,38.09 J8.2
  Bottom 0.152: R6.2 4.99,37.25 v4.96,37.21 5.59,36.58 5.59,34.8 5.84,34.55 Q1.2
SDA_5V  (via drill 0.25 pad 0.51)
  Top 0.152: v4.96,33.53 5.46,33.02 14.23,33.02 15.05,32.2 15.12,32.13 U2.27
  Bottom 0.152: R7.2 4.99,33.5 v4.96,33.53 4.57,33.91 Q1.3
VCC  (via drill 0.25 pad 0.51)
  Top 0.406: 24.01,34.74 12.64,34.74 v11.05,36.32
  Top 1.016: v33.15,34.74 v32.51,34.74 24.01,34.74 23.56,34.74 23.1,35.2 J8.3
  Bottom 0.254: U6.8 29.48,24.12 29.21,24.39 | U6.7 29.34,23.62 29.21,23.75 | 29.21,23.75 29.09,23.88 | 29.21,23.75 29.21,24.01
  Bottom 0.406: v11.05,36.32 Q2.1 10.16,37.56 R8.1 9.75,38.64 9.4,38.99 6.61,38.99 6.19,38.58 R6.1 6.61,37.56 Q1.1
  Bottom 1.016: 32.51,34.1 v32.51,34.74 v33.15,34.74 32.51,34.1 | 29.85,26.93 29.85,28.2 32.51,30.86 32.51,34.1
  pour Bottom (isolate 0.254, no thermals): 28.07,23.75 29.21,23.75 29.47,24.01 29.59,24.01 29.72,24.13 29.72,24.64 30.36,25.28 30.36,27.18 30.23,27.31 29.21,27.31 29.09,27.18 29.09,25.91 27.82,24.64 27.82,24.01
VCC_3V  (via drill 0.25 pad 0.51)
  Top 0.406: v25.28,25.28 25.28,23.37 v26.55,22.1 | TP12.T 32.26,19.56 v32.01,19.81
  Bottom 0.406: R45.2 33.02,18.54 | R31.1 23.34,26.45 24.51,25.28 v25.28,25.28
  pour Bottom (isolate 0.254, no thermals): 32.77,22.86 35.56,22.86 35.69,22.74 35.69,21.85 35.44,21.59 33.64,21.59 33.28,21.23 33.28,18.42 29.34,14.48 21.46,14.48 20.2,15.75 18.67,15.75 18.04,16.39 18.04,18.67 18.67,19.31 20.83,19.31 21.08,19.05 21.08,17.32 21.77,16.64 26.8,16.64 27.43,17.27 27.43,20.93 27.15,21.21 24.06,21.21 23.5,21.78 23.5,22.35 23.75,22.61 24.77,22.61 25.15,22.99 26.93,22.99 27.82,22.1 28.65,22.1 28.83,21.92 28.83,19.69 29.47,19.05 30.61,19.05 30.99,19.43 30.99,21.59 31.24,21.85 31.75,21.85
VCC_5V  (via drill 0.25 pad 0.51)
  Top 0.406: v24.13,18.93 23.24,18.93 17.53,24.64 v17.15,24.64 | TP1.T v12.58,29.72
  Bottom 0.406: C4.2 v24.13,18.93 24.29,19.09 R3.1
  pour Bottom (isolate 0.254, no thermals): 21.97,24.13 20.96,24.13 20.45,23.62 16.89,23.62 16.77,23.75 16.77,26.29 15.88,27.18 9.65,27.18 9.4,27.43 9.4,29.87 9.76,30.23 17.02,30.23 21.97,25.28

### Text on the board
tPlace: SCL | SDA | VCC | GND | LED Matrix Driver (HT16K33) | v1.0 | + | - | Address | A2 | A1 | A0 | 0x70 | DC 5V input | AD
Reference: 4P-SMD-2.0-90D | 4P-SMD-2.0 | 4P-2.0 | bottom / H<=5.4MM | First Choice | TP | GND | VCC | SIG/RX | SIG/READ VOL/TX